# EAGLE design UA18_Dash (EAGLE 8.2.0)

## Sheet 1 of 2
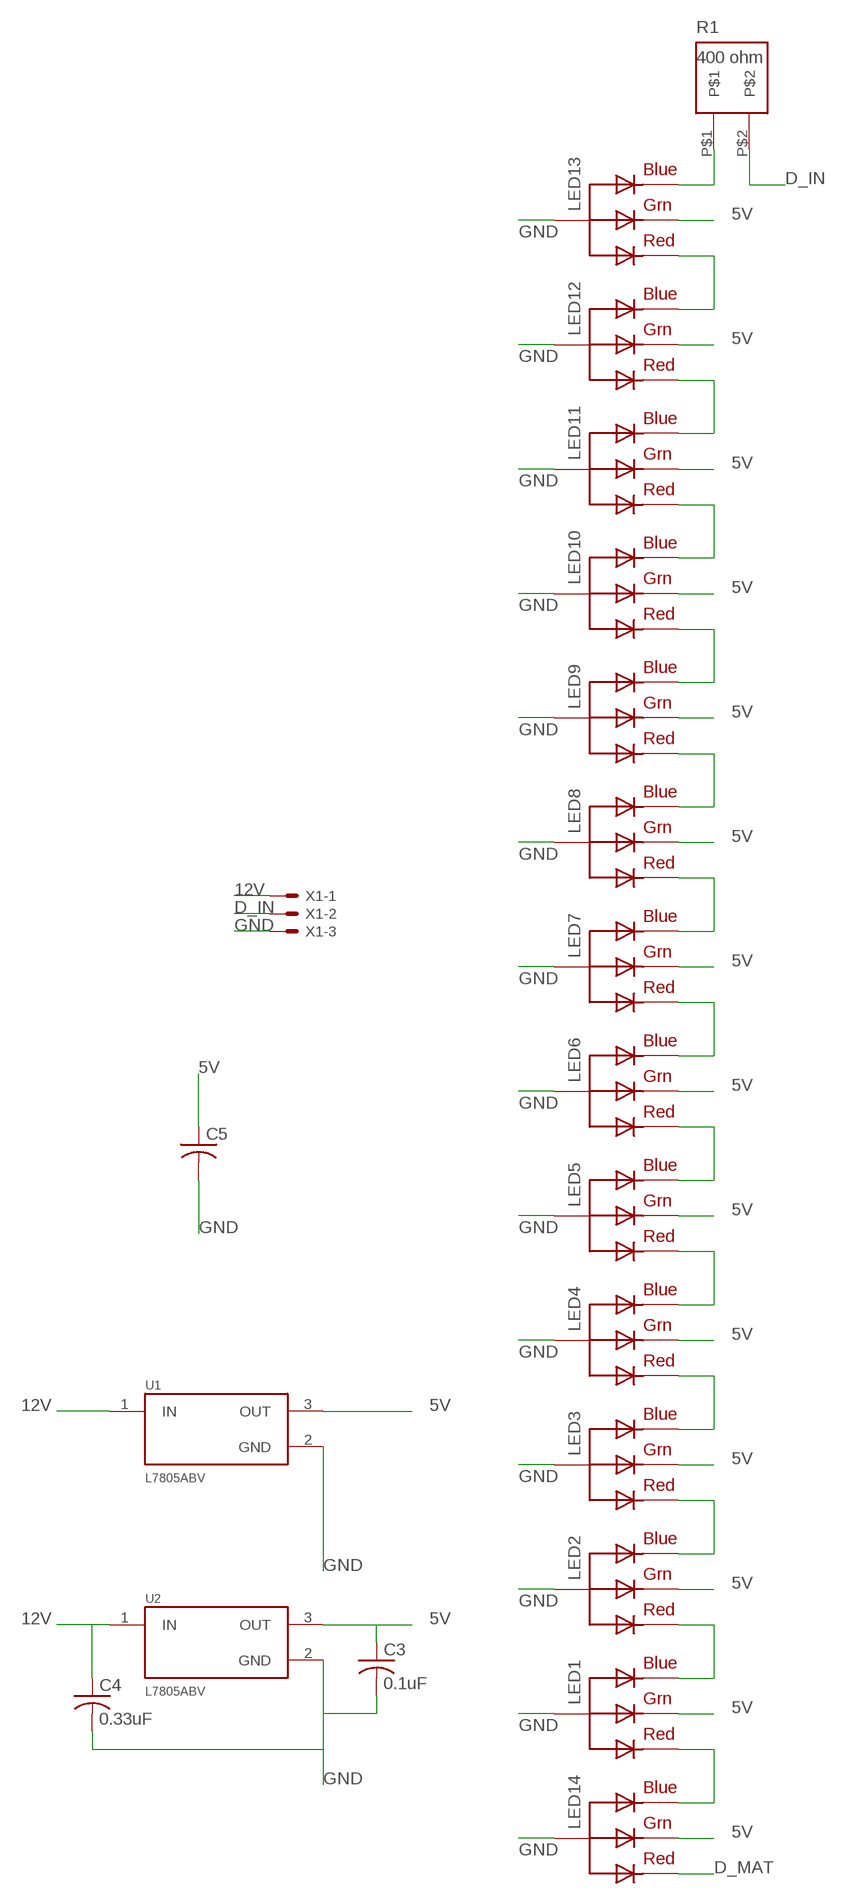
[diagram p0: schematic, sheet 1]

### Parts
C3  0.1uF  C-US050-024X044  [C050-024X044]
C4  0.33uF  C-US050-024X044  [C050-024X044]
C5  C-US275-093X316  [C275-093X316]
LED1  RGBLED_CA-5MM  [LED5MMRGB]
LED2  RGBLED_CA-5MM  [LED5MMRGB]
LED3  RGBLED_CA-5MM  [LED5MMRGB]
LED4  RGBLED_CA-5MM  [LED5MMRGB]
LED5  RGBLED_CA-5MM  [LED5MMRGB]
LED6  RGBLED_CA-5MM  [LED5MMRGB]
LED7  RGBLED_CA-5MM  [LED5MMRGB]
LED8  RGBLED_CA-5MM  [LED5MMRGB]
LED9  RGBLED_CA-5MM  [LED5MMRGB]
LED10  RGBLED_CA-5MM  [LED5MMRGB]
LED11  RGBLED_CA-5MM  [LED5MMRGB]
LED12  RGBLED_CA-5MM  [LED5MMRGB]
LED13  RGBLED_CA-5MM  [LED5MMRGB]
LED14  RGBLED_CA-5MM  [LED5MMRGB]
R1  400 ohm  684-MP915-400  [TO-126]
U1  L7805ABV  [TO254P460X1020X1945-3P]
U2  L7805ABV  [TO254P460X1020X1945-3P]
X1  KK-156-3  [KK-156-3]

### Nets
5V: C3.1 C5.1 LED1.3(GREEN) LED2.3(GREEN) LED3.3(GREEN) LED4.3(GREEN) LED5.3(GREEN) LED6.3(GREEN) LED7.3(GREEN) LED8.3(GREEN) LED9.3(GREEN) LED10.3(GREEN) LED11.3(GREEN) LED12.3(GREEN) LED13.3(GREEN) LED14.3(GREEN) U1.3(OUT) U2.3(OUT) ; also sheet 2
12V: C4.1 U1.1(IN) U2.1(IN) X1.1
D_IN: R1.P$2 X1.2
D_MAT: LED14.1(RED) ; also sheet 2
DO_L1: LED6.4(BLUE) LED7.1(RED)
DO_L2: LED12.4(BLUE) LED13.1(RED)
DO_L3: LED11.4(BLUE) LED12.1(RED)
DO_L4: LED10.4(BLUE) LED11.1(RED)
DO_L5: LED9.4(BLUE) LED10.1(RED)
DO_L6: LED8.4(BLUE) LED9.1(RED)
DO_L7: LED7.4(BLUE) LED8.1(RED)
DO_L8: LED5.4(BLUE) LED6.1(RED)
DO_L10: LED3.4(BLUE) LED4.1(RED)
DO_L11: LED2.4(BLUE) LED3.1(RED)
DO_L12: LED1.1(RED) LED1.4(BLUE) LED2.1(RED) LED14.4(BLUE)
GND: C3.2 C4.2 C5.2 LED1.2(VCC) LED2.2(VCC) LED3.2(VCC) LED4.2(VCC) LED5.2(VCC) LED6.2(VCC) LED7.2(VCC) LED8.2(VCC) LED9.2(VCC) LED10.2(VCC) LED11.2(VCC) LED12.2(VCC) LED13.2(VCC) LED14.2(VCC) U1.2(GND) U2.2(GND) X1.3 ; also sheet 2
N$2: LED13.4(BLUE) R1.P$1
N$9: LED4.4(BLUE) LED5.1(RED)

## Sheet 2 of 2
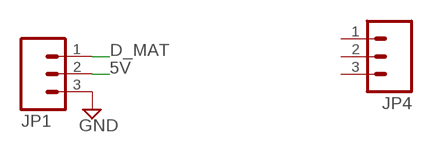
[diagram p1: schematic, sheet 2]

### Parts
JP1  M03PTH  [1X03]
JP4  M03PTH  [1X03]

### Nets
5V: JP1.2 ; also sheet 1
D_MAT: JP1.1 ; also sheet 1
GND: JP1.3 ; also sheet 1
Unconnected: JP4.1 JP4.2 JP4.3

## Library data of the parts
C3-C5 = adafruit:C-US: CAPACITOR, American symbol
JP1 JP4 = neomatrix-8x8:M03: Header 3 Standard 3-pin 0.1" header. Use with straight break away headers (SKU : PRT-00116), right angle break away headers (PRT-00553), swiss pins (PRT-00743), machine pins (PRT-00117), and female headers (PRT-00115). Molex polarized connector foot print use with SKU : PRT-08232 with associated crimp pins and housings.
LED1-LED14 = adafruit:RGBLED_CA: RGB LED, common-anode 5MM Staggered pins 5mm Piranha package http://www.ladyada.net/library/pcb/eaglelibrary.html
R1 = FSAE_FRED:684-MP915-400
U1 U2 = L7805ABV:L7805ABV: L7805 Series 1.5 A 5 V Three Terminal Voltage Regulator - TO-220; AVAILABILITY: Good; DESCRIPTION: IC REG LINEAR 5V 1.5A TO220AB; MF: STMicroelectronics; MP: L7805ABV; PACKAGE: TO-220 STMicroelectronics; PRICE: 0.27 USD
X1 = con-molex:KK-156-3: KK 156 HEADER Source: http://www.molex.com/pdm_docs/sd/026604100_sd.pdf; MF: MOLEX; OC_FARNELL: unknown; OC_NEWARK: unknown

## Board
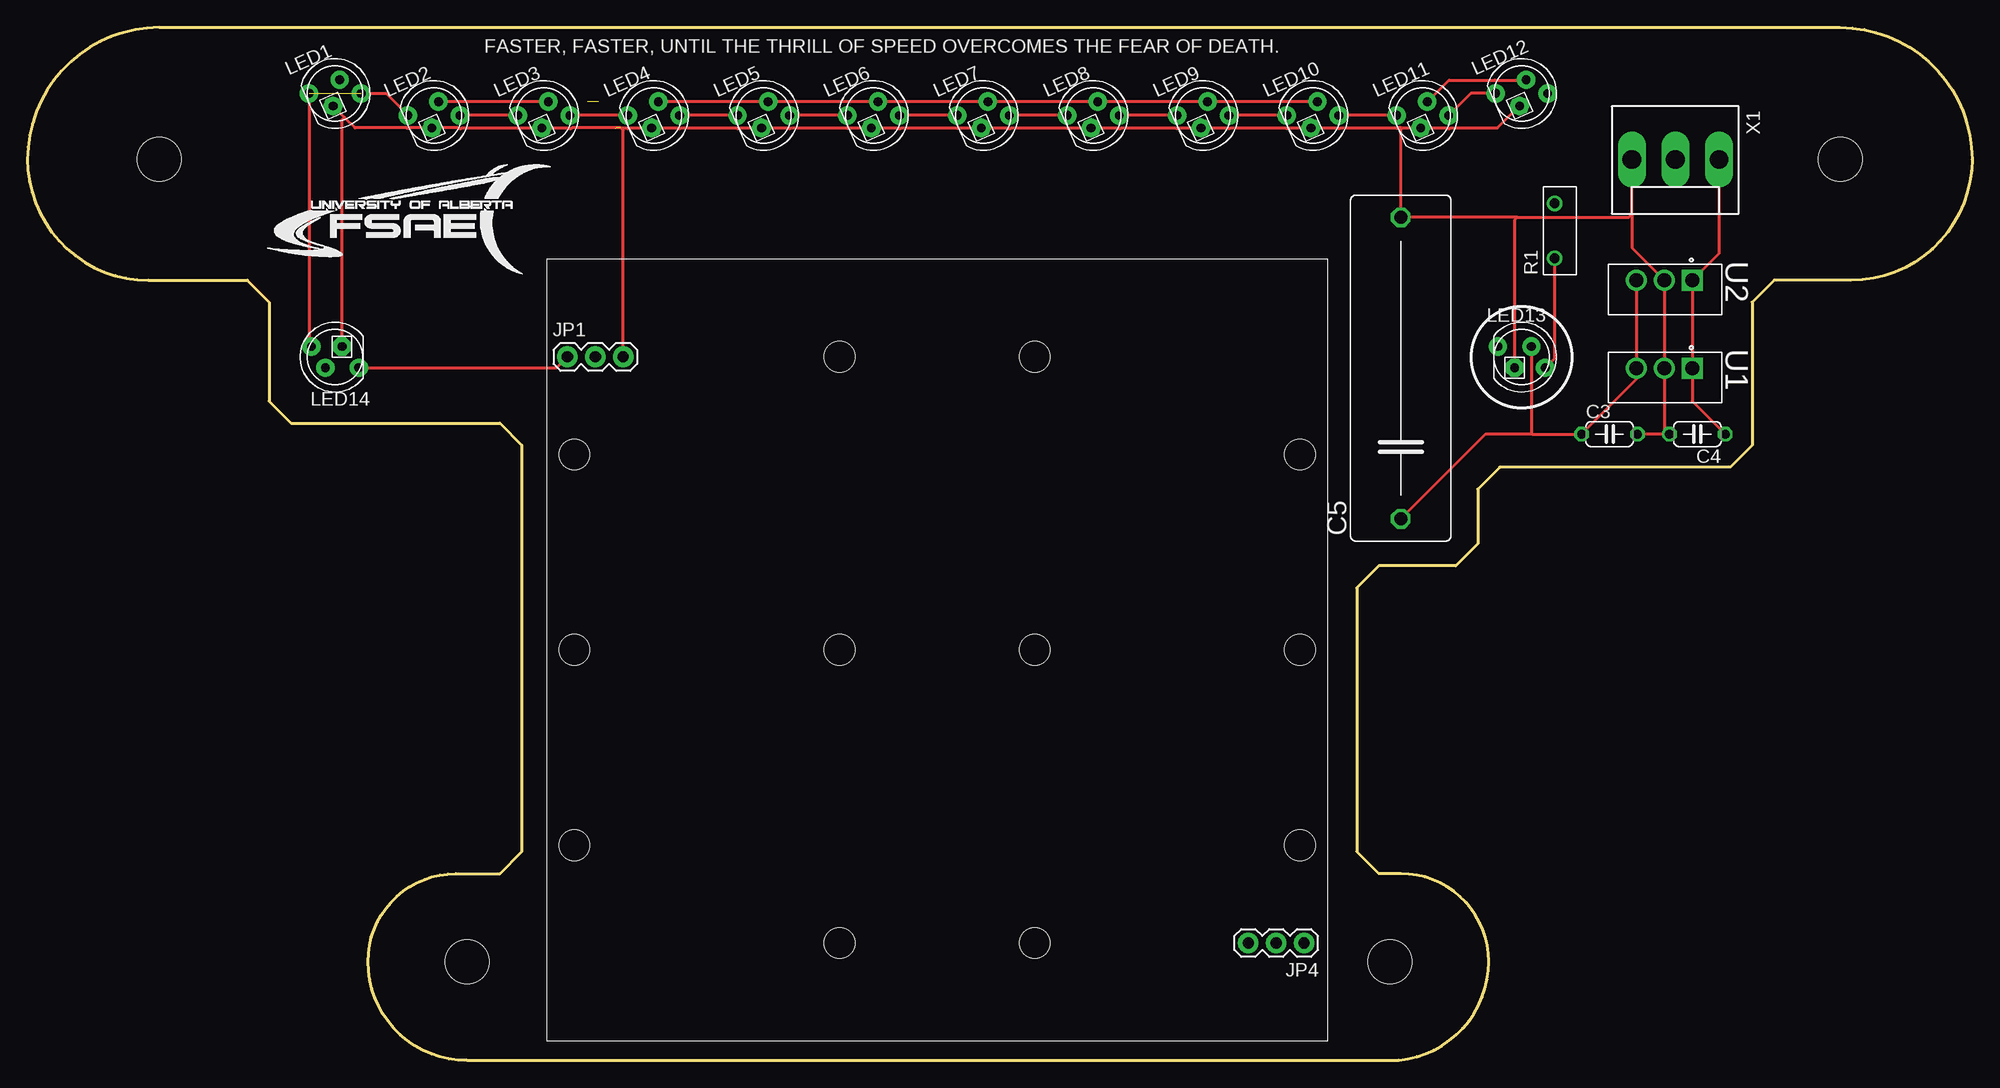
[diagram p2: board, top side]
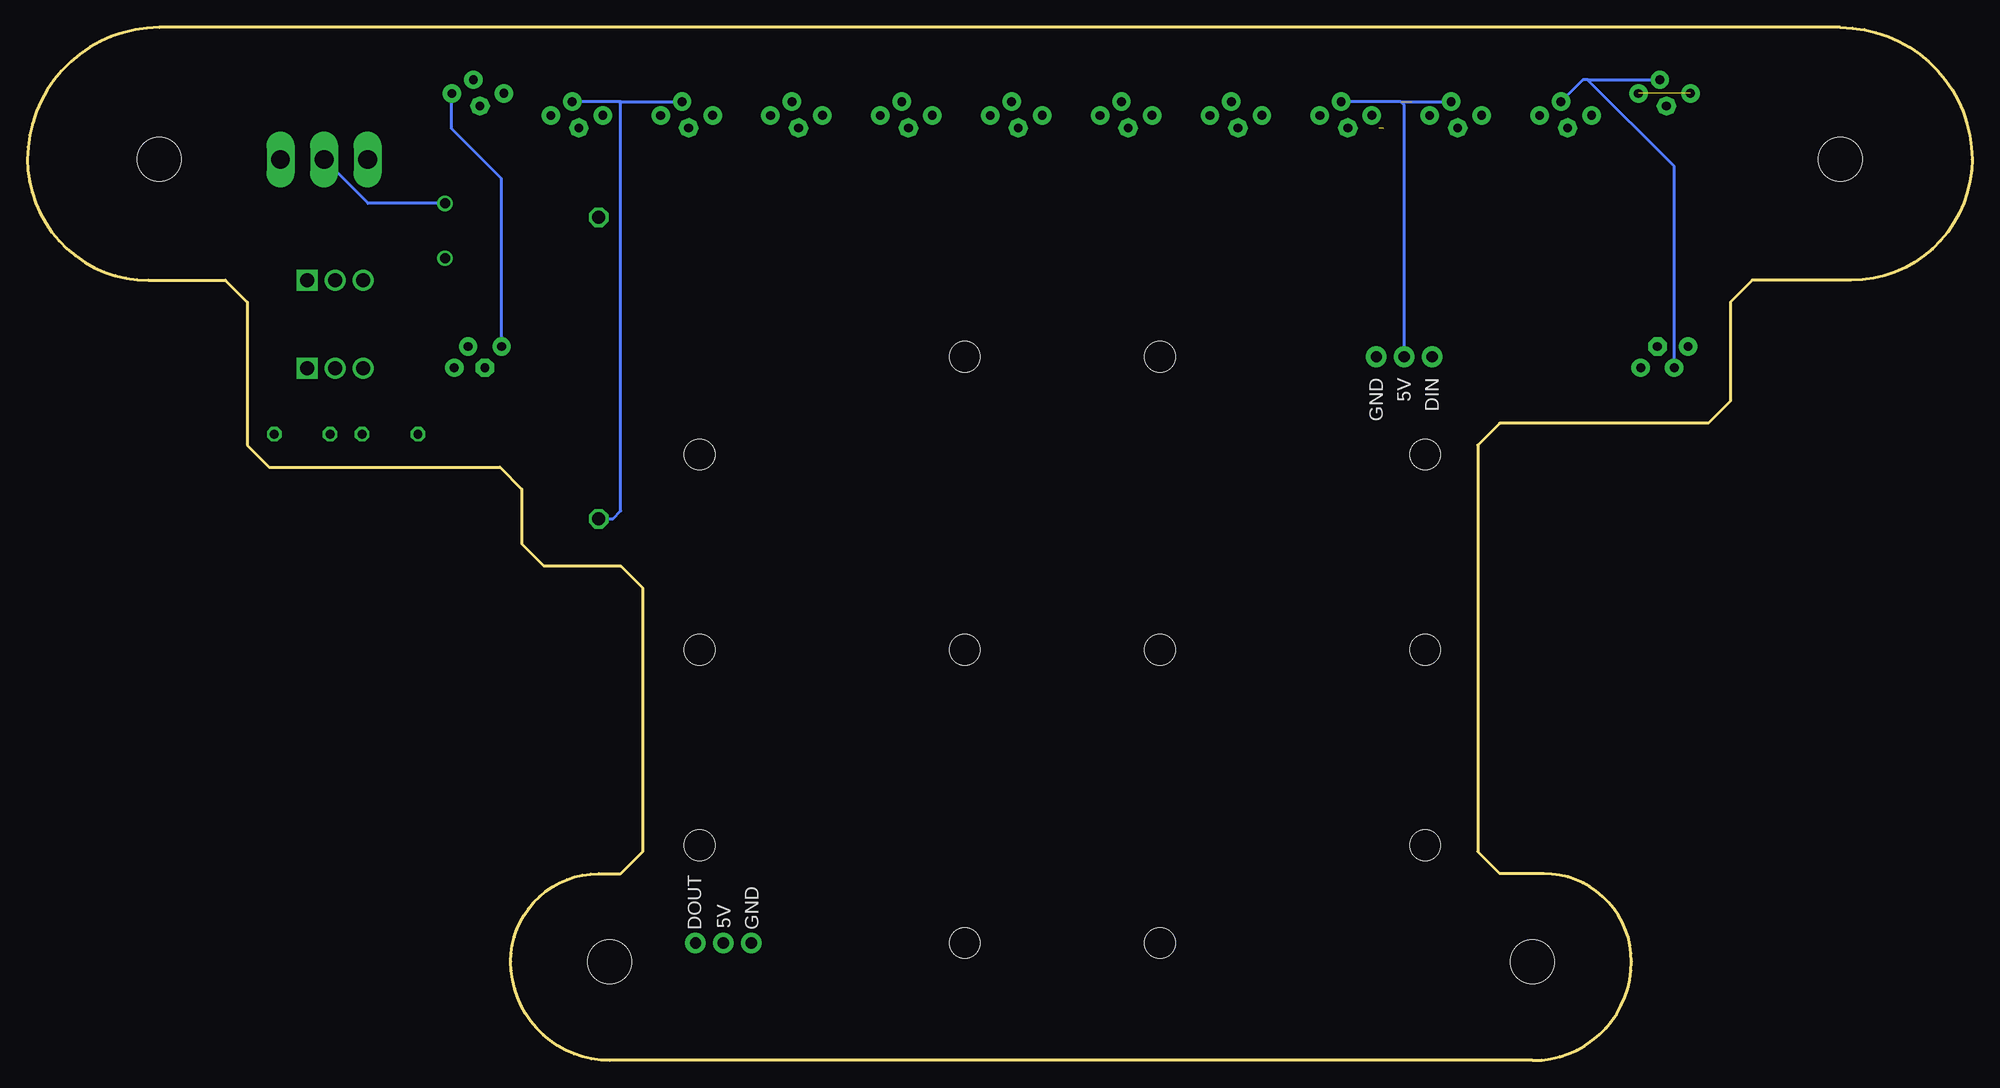
[diagram p3: board, bottom side, seen from below]

Size 177 x 94 mm. Coordinates in mm from the lower left corner, seen from the top.
Outline: 12,94 165,94 arc-90 177,82 arc-90 166,71 159,71 157,69 157,56 155,54 134,54 132,52 132,47 130,45 123,45 121,43 121,19 123,17 125,17 arc-90 133,9 arc-90 124,0 40,0 arc-90 31,9 arc-90 39,17 43,17 45,19 45,56 43,58 24,58 22,60 22,69 20,71 11,71 arc-90 0,82 arc-90 12,94
Copper layers (1*16): Top 0.035mm / dielectric 1.5mm / Bottom 0.035mm
Design rules "default": minimum track width 6mil, minimum drill 0.35mm, track to track 6mil, track to pad 6mil, pad to pad 6mil, via to via 6mil, smd to smd 6mil, copper to edge 40mil, drill to drill 6mil, minimum pad ring 10mil, minimum via ring 8mil, stop-mask expansion 4mil, vias tented up to drill 0mil, thermal gap 10mil
Holes 4 mm at 12,82 165,82 40,9 124,9
Holes 2.8 mm at 49.78,55.14 49.78,37.36 49.78,19.58 115.82,19.58 115.82,37.36 115.82,55.14 73.91,64.03 91.69,64.03 73.91,37.36 91.69,37.36 73.91,10.69 91.69,10.69

### Footprints (pad centres in the part's own frame; a part is rotated, then mirrored left to right if it is on the bottom)
C050-024X044 = drill 0.813 octagon: 1 -2.54,0; 2 2.54,0
C275-093X316 = drill 1.194 octagon: 1 -13.716,0; 2 13.716,0
1X03 = drill 1.016 pad 1.88: 1 0,0; 2 2.54,0; 3 5.08,0
LED5MMRGB = drill 0.8 pad 1.676: 1 -2.159,0.968; 3 0.889,0.968; 4 2.159,-0.968 | drill 0.8 pad 1.676 octagon: 2 -0.635,-0.968
TO-126 = drill 0.9: P$1 0,0; P$2 5,0
TO254P460X1020X1945-3P = drill 1.27 pad 1.91 square: 1 0,2.54 | drill 1.27 pad 1.91: 2 0,0; 3 0,-2.54
KK-156-3 = drill 1.7 pad 2.184 long: 1 -3.96,0; 2 0,0; 3 3.96,0

### Placement (x,y rotation side)
C3  144,57 0 top
C4  152,57 180 top
C5  125,63 90 top
JP1  49.15,64.03 0 top
JP4  116.2,10.69 180 top
LED1  28,88 24 top
LED2  37,86 24 top
LED3  47,86 24 top
LED4  57,86 24 top
LED5  67,86 24 top
LED6  77,86 24 top
LED7  87,86 24 top
LED8  97,86 24 top
LED9  107,86 24 top
LED10  117,86 24 top
LED11  127,86 24 top
LED12  136,88 24 top
LED13  136,64 0 top
LED14  28,64 180 top
R1  139,73 90 top
U1  149,63 270 top
U2  149,71 270 top
X1  150,82 180 top

### Tracks (layer width: path | path; a pad name or v marks a point on that pad's centre or on a via)
5V  (2 unrouted)
  Top 0.254: LED10.3 LED9.3 LED8.3 LED7.3 LED6.3 LED5.3 LED4.3 | LED3.3 LED2.3 | LED11.3 127.45,87.25 129.4,89.2 133.57,89.2 133.6,89.22 136.39,89.22 LED12.3 | U2.3 U1.3 146.46,62 C3.1 137,57 | 137,57 132.72,57 C5.1 | LED13.3 136.89,57.11 137,57
  Bottom 0.254: 123,87.25 LED10.3 | 123,87.25 LED11.3 | C5.1 123.72,49.28 123,50 123,87.25 | 52,87.25 LED3.3 | 52,87.25 LED4.3 | 35,89.25 LED1.3 | 35,89.25 35.42,89.25 LED2.3 | LED14.3 27.11,81.36 35,89.25 | JP1.2 51.69,86.93 52,87.25
12V
  Top 0.254: C4.1 151.54,60 U1.1 U2.1 153.96,73.42 X1.1
D_IN
  Bottom 0.254: R1.P$2 146,78 X1.2
D_MAT
  Top 0.254: LED14.1 48.15,63.03 JP1.1
DO_L1
  Top 0.254: LED7.1 79.38,86.01 LED6.4
DO_L2
  Bottom 0.254: LED13.1 133.84,80.24 138.4,84.8 138.4,87.96 LED12.4
DO_L3
  Top 0.254: LED12.1 131.38,88.01 LED11.4
DO_L4
  Top 0.254: LED11.1 119.38,86.01 LED10.4
DO_L5
  Top 0.254: LED10.1 109.38,86.01 LED9.4
DO_L6
  Top 0.254: LED9.1 99.38,86.01 LED8.4
DO_L7
  Top 0.254: LED8.1 89.38,86.01 LED7.4
DO_L8
  Top 0.254: LED6.1 69.38,86.01 LED5.4
DO_L10
  Top 0.254: LED4.1 49.38,86.01 LED3.4
DO_L11
  Top 0.254: LED3.1 39.38,86.01 LED2.4
DO_L12  (1 unrouted)
  Top 0.254: LED1.4 32.65,87.99 LED2.1 | LED1.1 25.63,65.18 LED14.4
GND  (2 unrouted)
  Top 0.254: 54,84.86 49.56,84.86 49.4,84.78 49.21,84.86 LED3.2 44.8,84.86 44.66,84.8 44.51,84.86 39.56,84.86 39.4,84.78 39.21,84.86 LED2.2 34.8,84.86 34.66,84.8 34.51,84.86 29.81,84.86 28.84,85.84 | 54,84.86 54.51,84.86 54.66,84.8 54.8,84.86 LED4.2 59.21,84.86 59.4,84.78 59.56,84.86 64.51,84.86 64.66,84.8 64.8,84.86 LED5.2 69.21,84.86 69.4,84.78 69.56,84.86 74.51,84.86 74.66,84.8 74.8,84.86 LED6.2 79.21,84.86 79.4,84.78 79.56,84.86 84.51,84.86 84.67,84.8 84.8,84.86 LED7.2 89.21,84.86 89.4,84.78 89.56,84.86 94.51,84.86 94.67,84.8 94.8,84.86 LED8.2 99.21,84.86 99.4,84.78 99.56,84.86 104.51,84.86 104.67,84.8 104.8,84.86 LED9.2 109.21,84.86 109.4,84.78 109.56,84.86 114.51,84.86 114.67,84.8 114.8,84.86 LED10.2 119.21,84.86 119.4,84.78 119.56,84.86 124.51,84.86 124.67,84.8 124.8,84.86 125,84.86 | 125,84.86 LED11.2 129.21,84.86 129.4,84.78 129.56,84.86 133.81,84.86 LED12.2 | 28.84,85.84 LED1.2 | 149,57 C3.2 | 149,57 C4.2 | 149,57 U1.2 U2.2 146.04,73.96 146.04,77 | 146.04,77 X1.3 | 135.6,76.72 145.76,76.72 146.04,77 | 135.6,76.72 C5.2 125,84.86 | LED13.2 135.37,76.48 135.6,76.72 | LED14.2 28.64,85.64 28.84,85.84 | JP1.3 54.23,84.63 54,84.86
N$2
  Top 0.254: R1.P$1 139,63.87 LED13.4
N$9
  Top 0.254: LED5.1 59.38,86.01 LED4.4

### Text on the board
tPlace: FASTER, FASTER, UNTIL THE THRILL OF SPEED OVERCOMES THE FEAR OF DEATH.
bPlace: DIN | 5V | GND | GND | 5V | DOUT